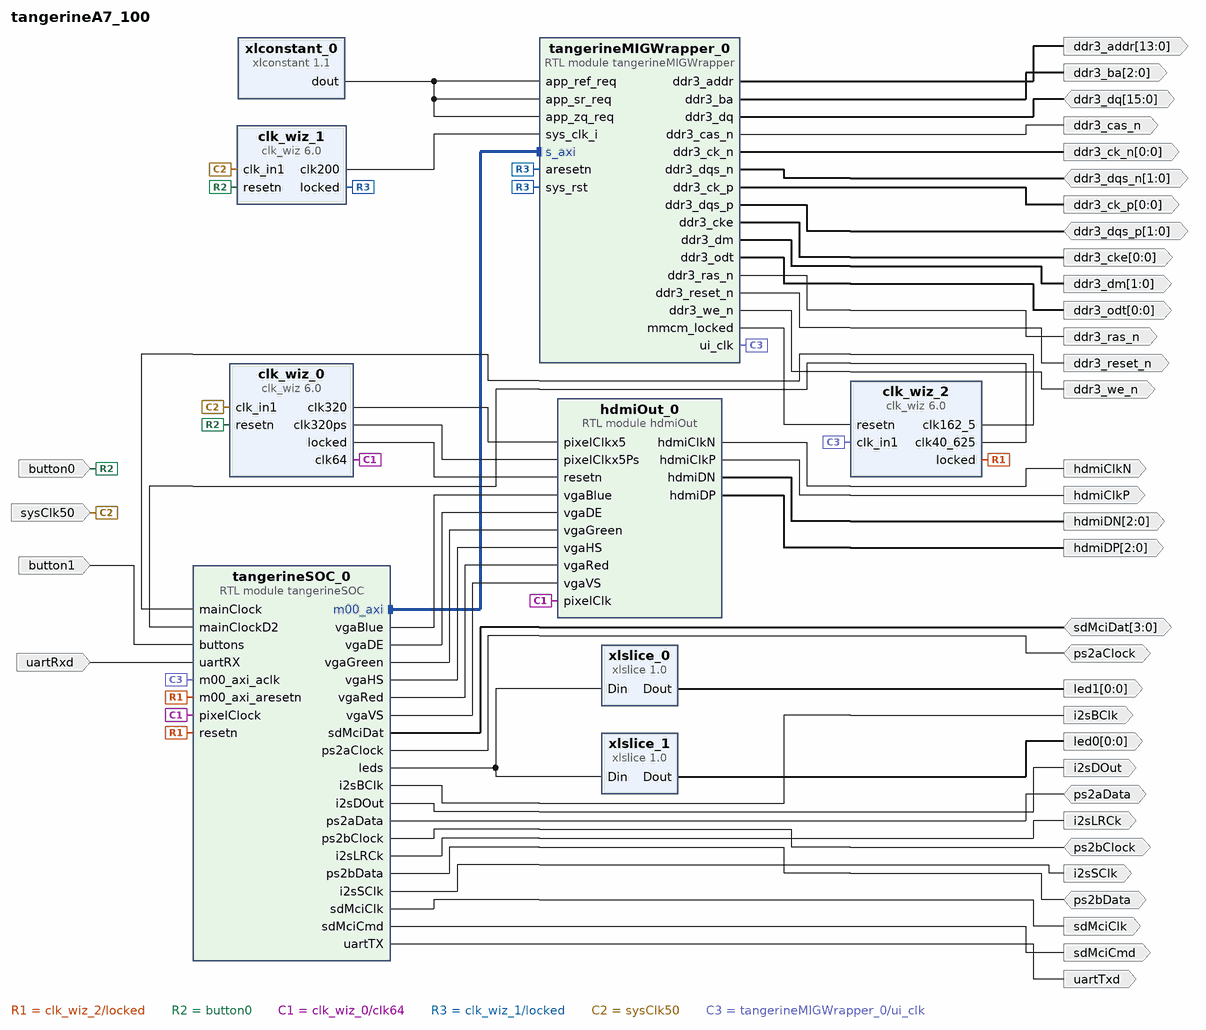
[diagram p0: block diagram of the top level]
# Vivado block design tangerineA7_100, xc7a100tfgg676-1, Vivado 2023.1
create_bd_design tangerineA7_100

create_bd_port -dir I -type clk sysClk50
set_property -dict {CONFIG.FREQ_HZ 50000000} [get_bd_ports sysClk50]
create_bd_port -dir O uartTxd
create_bd_port -dir I uartRxd
create_bd_port -dir I -type rst button0
create_bd_port -dir I button1
create_bd_port -dir O -from 0 -to 0 led0
create_bd_port -dir O -from 0 -to 0 led1
create_bd_port -dir O hdmiClkP
create_bd_port -dir O hdmiClkN
create_bd_port -dir O -from 2 -to 0 hdmiDP
create_bd_port -dir O -from 2 -to 0 hdmiDN
create_bd_port -dir IO -from 3 -to 0 sdMciDat
create_bd_port -dir O sdMciCmd
create_bd_port -dir O sdMciClk
create_bd_port -dir O -from 13 -to 0 ddr3_addr
create_bd_port -dir O -from 2 -to 0 ddr3_ba
create_bd_port -dir O ddr3_cas_n
create_bd_port -dir O -from 0 -to 0 ddr3_ck_n
create_bd_port -dir O -from 0 -to 0 ddr3_ck_p
create_bd_port -dir O -from 0 -to 0 ddr3_cke
create_bd_port -dir O ddr3_ras_n
create_bd_port -dir O ddr3_reset_n
create_bd_port -dir O ddr3_we_n
create_bd_port -dir IO -from 15 -to 0 ddr3_dq
create_bd_port -dir IO -from 1 -to 0 ddr3_dqs_n
create_bd_port -dir IO -from 1 -to 0 ddr3_dqs_p
create_bd_port -dir O -from 1 -to 0 ddr3_dm
create_bd_port -dir O -from 0 -to 0 ddr3_odt
create_bd_port -dir IO ps2aClock
create_bd_port -dir IO ps2aData
create_bd_port -dir IO ps2bClock
create_bd_port -dir IO ps2bData
create_bd_port -dir O i2sSClk
create_bd_port -dir O i2sBClk
create_bd_port -dir O i2sLRCk
create_bd_port -dir O i2sDOut

create_bd_cell -type ip -vlnv xilinx.com:ip:clk_wiz:6.0 clk_wiz_0
set_property -dict [list \
  CONFIG.CLKIN1_JITTER_PS 200.0 \
  CONFIG.CLKOUT1_JITTER 651.823 \
  CONFIG.CLKOUT1_PHASE_ERROR 919.522 \
  CONFIG.CLKOUT1_REQUESTED_OUT_FREQ 64 \
  CONFIG.CLKOUT1_USED true \
  CONFIG.CLKOUT2_JITTER 523.758 \
  CONFIG.CLKOUT2_PHASE_ERROR 919.522 \
  CONFIG.CLKOUT2_REQUESTED_OUT_FREQ 320 \
  CONFIG.CLKOUT2_USED true \
  CONFIG.CLKOUT3_JITTER 523.758 \
  CONFIG.CLKOUT3_PHASE_ERROR 919.522 \
  CONFIG.CLKOUT3_REQUESTED_OUT_FREQ 320 \
  CONFIG.CLKOUT3_REQUESTED_PHASE 180 \
  CONFIG.CLKOUT3_USED true \
  CONFIG.CLKOUT4_JITTER 162.035 \
  CONFIG.CLKOUT4_PHASE_ERROR 164.985 \
  CONFIG.CLKOUT4_USED false \
  CONFIG.CLK_OUT1_PORT clk64 \
  CONFIG.CLK_OUT2_PORT clk320 \
  CONFIG.CLK_OUT3_PORT clk320ps \
  CONFIG.CLK_OUT4_PORT clk100 \
  CONFIG.MMCM_CLKFBOUT_MULT_F 64.000 \
  CONFIG.MMCM_CLKIN1_PERIOD 20.000 \
  CONFIG.MMCM_CLKIN2_PERIOD 10.0 \
  CONFIG.MMCM_CLKOUT0_DIVIDE_F 10.000 \
  CONFIG.MMCM_CLKOUT1_DIVIDE 2 \
  CONFIG.MMCM_CLKOUT2_DIVIDE 2 \
  CONFIG.MMCM_CLKOUT2_PHASE 180.000 \
  CONFIG.MMCM_CLKOUT3_DIVIDE 1 \
  CONFIG.MMCM_DIVCLK_DIVIDE 5 \
  CONFIG.NUM_OUT_CLKS 3 \
  CONFIG.PRIM_IN_FREQ 50.000 \
  CONFIG.PRIM_SOURCE Global_buffer \
  CONFIG.RESET_PORT resetn \
  CONFIG.RESET_TYPE ACTIVE_LOW \
] [get_bd_cells clk_wiz_0]
create_bd_cell -type module -reference hdmiOut hdmiOut_0
create_bd_cell -type ip -vlnv xilinx.com:ip:clk_wiz:6.0 clk_wiz_1
set_property -dict [list \
  CONFIG.CLKIN1_JITTER_PS 200.0 \
  CONFIG.CLKOUT1_JITTER 142.107 \
  CONFIG.CLKOUT1_PHASE_ERROR 164.985 \
  CONFIG.CLKOUT1_REQUESTED_OUT_FREQ 200.000 \
  CONFIG.CLKOUT2_JITTER 162.035 \
  CONFIG.CLKOUT2_PHASE_ERROR 164.985 \
  CONFIG.CLKOUT2_REQUESTED_PHASE 190 \
  CONFIG.CLKOUT2_USED false \
  CONFIG.CLKOUT3_JITTER 192.113 \
  CONFIG.CLKOUT3_PHASE_ERROR 164.985 \
  CONFIG.CLKOUT3_REQUESTED_OUT_FREQ 50 \
  CONFIG.CLKOUT3_USED false \
  CONFIG.CLKOUT4_JITTER 142.107 \
  CONFIG.CLKOUT4_PHASE_ERROR 164.985 \
  CONFIG.CLKOUT4_REQUESTED_OUT_FREQ 200 \
  CONFIG.CLKOUT4_USED false \
  CONFIG.CLK_OUT1_PORT clk200 \
  CONFIG.CLK_OUT2_PORT clk100ps \
  CONFIG.CLK_OUT3_PORT clk50 \
  CONFIG.CLK_OUT4_PORT clk200 \
  CONFIG.MMCM_CLKFBOUT_MULT_F 20.000 \
  CONFIG.MMCM_CLKIN1_PERIOD 20.000 \
  CONFIG.MMCM_CLKIN2_PERIOD 10.0 \
  CONFIG.MMCM_CLKOUT0_DIVIDE_F 5.000 \
  CONFIG.MMCM_CLKOUT1_DIVIDE 1 \
  CONFIG.MMCM_CLKOUT1_PHASE 189.000 \
  CONFIG.MMCM_CLKOUT2_DIVIDE 1 \
  CONFIG.MMCM_CLKOUT3_DIVIDE 1 \
  CONFIG.NUM_OUT_CLKS 1 \
  CONFIG.PRIM_IN_FREQ 50 \
  CONFIG.PRIM_SOURCE Global_buffer \
  CONFIG.RESET_PORT resetn \
  CONFIG.RESET_TYPE ACTIVE_LOW \
] [get_bd_cells clk_wiz_1]
create_bd_cell -type ip -vlnv xilinx.com:ip:xlslice:1.0 xlslice_0
set_property -dict {CONFIG.DIN_FROM 1 CONFIG.DIN_TO 1 CONFIG.DIN_WIDTH 2} [get_bd_cells xlslice_0]
create_bd_cell -type ip -vlnv xilinx.com:ip:xlconstant:1.1 xlconstant_0
set_property -dict {CONFIG.CONST_VAL 0} [get_bd_cells xlconstant_0]
create_bd_cell -type module -reference tangerineMIGWrapper tangerineMIGWrapper_0
create_bd_cell -type ip -vlnv xilinx.com:ip:clk_wiz:6.0 clk_wiz_2
set_property -dict [list \
  CONFIG.CLKIN1_JITTER_PS 123.07000000000001 \
  CONFIG.CLKOUT1_JITTER 139.978 \
  CONFIG.CLKOUT1_PHASE_ERROR 116.055 \
  CONFIG.CLKOUT1_REQUESTED_OUT_FREQ 162.5 \
  CONFIG.CLKOUT2_JITTER 161.616 \
  CONFIG.CLKOUT2_PHASE_ERROR 116.055 \
  CONFIG.CLKOUT2_REQUESTED_OUT_FREQ 81.250 \
  CONFIG.CLKOUT2_USED true \
  CONFIG.CLKOUT3_JITTER 139.978 \
  CONFIG.CLKOUT3_PHASE_ERROR 116.055 \
  CONFIG.CLKOUT3_REQUESTED_OUT_FREQ 162.5 \
  CONFIG.CLKOUT3_REQUESTED_PHASE 190 \
  CONFIG.CLKOUT3_USED true \
  CONFIG.CLKOUT4_JITTER 186.987 \
  CONFIG.CLKOUT4_PHASE_ERROR 116.055 \
  CONFIG.CLKOUT4_REQUESTED_OUT_FREQ 40.625 \
  CONFIG.CLKOUT4_USED true \
  CONFIG.CLK_OUT1_PORT clk162_5 \
  CONFIG.CLK_OUT2_PORT clk81_25 \
  CONFIG.CLK_OUT3_PORT clk162_5ps \
  CONFIG.CLK_OUT4_PORT clk40_625 \
  CONFIG.MMCM_CLKFBOUT_MULT_F 10.000 \
  CONFIG.MMCM_CLKIN1_PERIOD 12.308 \
  CONFIG.MMCM_CLKIN2_PERIOD 10.000 \
  CONFIG.MMCM_CLKOUT0_DIVIDE_F 5.000 \
  CONFIG.MMCM_CLKOUT1_DIVIDE 10 \
  CONFIG.MMCM_CLKOUT2_DIVIDE 5 \
  CONFIG.MMCM_CLKOUT2_PHASE 189.000 \
  CONFIG.MMCM_CLKOUT3_DIVIDE 20 \
  CONFIG.NUM_OUT_CLKS 4 \
  CONFIG.PRIM_IN_FREQ 81.250 \
  CONFIG.PRIM_SOURCE No_buffer \
  CONFIG.RESET_PORT resetn \
  CONFIG.RESET_TYPE ACTIVE_LOW \
] [get_bd_cells clk_wiz_2]
create_bd_cell -type ip -vlnv xilinx.com:ip:xlslice:1.0 xlslice_1
set_property -dict {CONFIG.DIN_WIDTH 2} [get_bd_cells xlslice_1]
create_bd_cell -type module -reference tangerineSOC tangerineSOC_0

# ---- connections ----

connect_bd_intf_net [get_bd_intf_pins tangerineSOC_0/m00_axi] [get_bd_intf_pins tangerineMIGWrapper_0/s_axi]
connect_bd_net [get_bd_ports sdMciDat] [get_bd_pins tangerineSOC_0/sdMciDat]
connect_bd_net [get_bd_pins xlconstant_0/dout] \
  [get_bd_pins tangerineMIGWrapper_0/app_sr_req] [get_bd_pins tangerineMIGWrapper_0/app_ref_req] \
  [get_bd_pins tangerineMIGWrapper_0/app_zq_req]
connect_bd_net [get_bd_ports ddr3_dq] [get_bd_pins tangerineMIGWrapper_0/ddr3_dq]
connect_bd_net [get_bd_ports ddr3_dqs_n] [get_bd_pins tangerineMIGWrapper_0/ddr3_dqs_n]
connect_bd_net [get_bd_ports ddr3_dqs_p] [get_bd_pins tangerineMIGWrapper_0/ddr3_dqs_p]
connect_bd_net [get_bd_ports ps2aClock] [get_bd_pins tangerineSOC_0/ps2aClock]
connect_bd_net [get_bd_ports ps2aData] [get_bd_pins tangerineSOC_0/ps2aData]
connect_bd_net [get_bd_ports ps2bClock] [get_bd_pins tangerineSOC_0/ps2bClock]
connect_bd_net [get_bd_ports ps2bData] [get_bd_pins tangerineSOC_0/ps2bData]
connect_bd_net [get_bd_pins clk_wiz_2/locked] [get_bd_pins tangerineSOC_0/resetn] [get_bd_pins tangerineSOC_0/m00_axi_aresetn]
connect_bd_net -net button0_1 [get_bd_ports button0] [get_bd_pins clk_wiz_0/resetn] [get_bd_pins clk_wiz_1/resetn]
connect_bd_net -net button1_1 [get_bd_ports button1] [get_bd_pins tangerineSOC_0/buttons]
connect_bd_net [get_bd_pins clk_wiz_0/clk64] [get_bd_pins hdmiOut_0/pixelClk] [get_bd_pins tangerineSOC_0/pixelClock]
connect_bd_net [get_bd_pins clk_wiz_0/clk320] [get_bd_pins hdmiOut_0/pixelClkx5]
connect_bd_net [get_bd_pins clk_wiz_0/clk320ps] [get_bd_pins hdmiOut_0/pixelClkx5Ps]
connect_bd_net [get_bd_pins clk_wiz_0/locked] [get_bd_pins hdmiOut_0/resetn]
connect_bd_net [get_bd_pins clk_wiz_1/clk200] [get_bd_pins tangerineMIGWrapper_0/sys_clk_i]
connect_bd_net [get_bd_pins clk_wiz_1/locked] [get_bd_pins tangerineMIGWrapper_0/aresetn] [get_bd_pins tangerineMIGWrapper_0/sys_rst]
connect_bd_net [get_bd_pins clk_wiz_2/clk162_5] [get_bd_pins tangerineSOC_0/mainClock]
connect_bd_net [get_bd_pins clk_wiz_2/clk40_625] [get_bd_pins tangerineSOC_0/mainClockD2]
connect_bd_net [get_bd_pins hdmiOut_0/hdmiClkN] [get_bd_ports hdmiClkN]
connect_bd_net [get_bd_pins hdmiOut_0/hdmiClkP] [get_bd_ports hdmiClkP]
connect_bd_net [get_bd_pins hdmiOut_0/hdmiDN] [get_bd_ports hdmiDN]
connect_bd_net [get_bd_pins hdmiOut_0/hdmiDP] [get_bd_ports hdmiDP]
connect_bd_net -net sysClk50_1 [get_bd_ports sysClk50] [get_bd_pins clk_wiz_0/clk_in1] [get_bd_pins clk_wiz_1/clk_in1]
connect_bd_net [get_bd_pins tangerineMIGWrapper_0/ddr3_addr] [get_bd_ports ddr3_addr]
connect_bd_net [get_bd_pins tangerineMIGWrapper_0/ddr3_ba] [get_bd_ports ddr3_ba]
connect_bd_net [get_bd_pins tangerineMIGWrapper_0/ddr3_cas_n] [get_bd_ports ddr3_cas_n]
connect_bd_net [get_bd_pins tangerineMIGWrapper_0/ddr3_ck_n] [get_bd_ports ddr3_ck_n]
connect_bd_net [get_bd_pins tangerineMIGWrapper_0/ddr3_ck_p] [get_bd_ports ddr3_ck_p]
connect_bd_net [get_bd_pins tangerineMIGWrapper_0/ddr3_cke] [get_bd_ports ddr3_cke]
connect_bd_net [get_bd_pins tangerineMIGWrapper_0/ddr3_dm] [get_bd_ports ddr3_dm]
connect_bd_net [get_bd_pins tangerineMIGWrapper_0/ddr3_odt] [get_bd_ports ddr3_odt]
connect_bd_net [get_bd_pins tangerineMIGWrapper_0/ddr3_ras_n] [get_bd_ports ddr3_ras_n]
connect_bd_net [get_bd_pins tangerineMIGWrapper_0/ddr3_reset_n] [get_bd_ports ddr3_reset_n]
connect_bd_net [get_bd_pins tangerineMIGWrapper_0/ddr3_we_n] [get_bd_ports ddr3_we_n]
connect_bd_net [get_bd_pins tangerineMIGWrapper_0/mmcm_locked] [get_bd_pins clk_wiz_2/resetn]
connect_bd_net [get_bd_pins tangerineMIGWrapper_0/ui_clk] [get_bd_pins clk_wiz_2/clk_in1] [get_bd_pins tangerineSOC_0/m00_axi_aclk]
connect_bd_net [get_bd_pins tangerineSOC_0/i2sBClk] [get_bd_ports i2sBClk]
connect_bd_net [get_bd_pins tangerineSOC_0/i2sDOut] [get_bd_ports i2sDOut]
connect_bd_net [get_bd_pins tangerineSOC_0/i2sLRCk] [get_bd_ports i2sLRCk]
connect_bd_net [get_bd_pins tangerineSOC_0/i2sSClk] [get_bd_ports i2sSClk]
connect_bd_net [get_bd_pins tangerineSOC_0/leds] [get_bd_pins xlslice_0/Din] [get_bd_pins xlslice_1/Din]
connect_bd_net [get_bd_pins tangerineSOC_0/sdMciClk] [get_bd_ports sdMciClk]
connect_bd_net [get_bd_pins tangerineSOC_0/sdMciCmd] [get_bd_ports sdMciCmd]
connect_bd_net [get_bd_pins tangerineSOC_0/uartTX] [get_bd_ports uartTxd]
connect_bd_net [get_bd_pins tangerineSOC_0/vgaBlue] [get_bd_pins hdmiOut_0/vgaBlue]
connect_bd_net [get_bd_pins tangerineSOC_0/vgaDE] [get_bd_pins hdmiOut_0/vgaDE]
connect_bd_net [get_bd_pins tangerineSOC_0/vgaGreen] [get_bd_pins hdmiOut_0/vgaGreen]
connect_bd_net [get_bd_pins tangerineSOC_0/vgaHS] [get_bd_pins hdmiOut_0/vgaHS]
connect_bd_net [get_bd_pins tangerineSOC_0/vgaRed] [get_bd_pins hdmiOut_0/vgaRed]
connect_bd_net [get_bd_pins tangerineSOC_0/vgaVS] [get_bd_pins hdmiOut_0/vgaVS]
connect_bd_net [get_bd_ports uartRxd] [get_bd_pins tangerineSOC_0/uartRX]
connect_bd_net [get_bd_pins xlslice_0/Dout] [get_bd_ports led1]
connect_bd_net [get_bd_pins xlslice_1/Dout] [get_bd_ports led0]

# ---- address map ----
assign_bd_address -offset 0x00000000 -range 256M -target_address_space [get_bd_addr_spaces tangerineSOC_0/m00_axi] [get_bd_addr_segs tangerineMIGWrapper_0/s_axi/reg0]

validate_bd_design
save_bd_design
